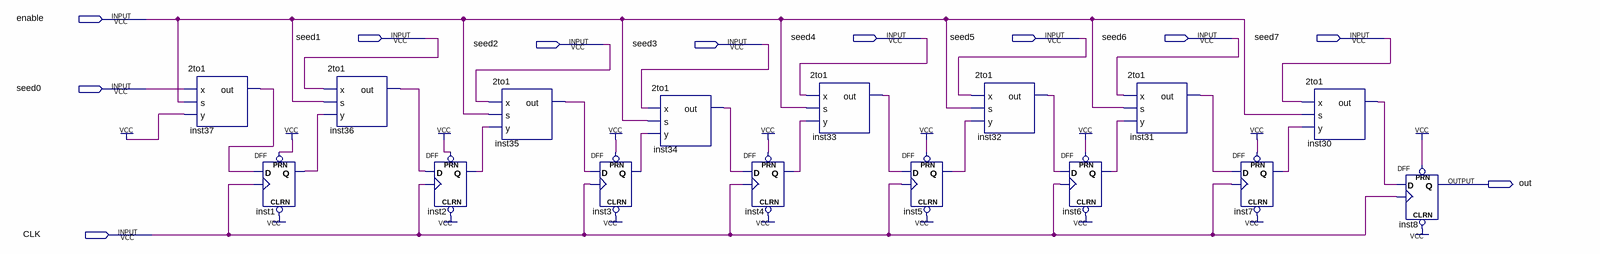
[diagram p0: schematic sheet]
// Quartus schematic 8bit.bdf as structural Verilog: 16 symbols, 11 pins
module \8bit  (
  input  enable,
  input  seed1,
  input  seed4,
  input  seed5,
  input  seed6,
  input  seed7,
  input  seed2,
  input  seed3,
  input  seed0,
  input  CLK,
  output out
);

  wire inst1_q, inst2_q, inst3_q, inst4_q, inst5_q, inst6_q, inst7_q, inst30_out, inst31_out, inst32_out,
       inst33_out, inst34_out, inst35_out, inst36_out, inst37_out;

  \2to1  inst37 (.x(seed0), .s(enable), .y(1'b1), .out(inst37_out));
  DFF inst1 (.CLRN(1'b1), .CLK(CLK), .D(inst37_out), .PRN(1'b1), .Q(inst1_q));
  \2to1  inst36 (.x(seed1), .s(enable), .y(inst1_q), .out(inst36_out));
  DFF inst2 (.CLRN(1'b1), .CLK(CLK), .D(inst36_out), .PRN(1'b1), .Q(inst2_q));
  \2to1  inst35 (.x(seed2), .s(enable), .y(inst2_q), .out(inst35_out));
  DFF inst3 (.CLRN(1'b1), .CLK(CLK), .D(inst35_out), .PRN(1'b1), .Q(inst3_q));
  \2to1  inst34 (.x(seed3), .s(enable), .y(inst3_q), .out(inst34_out));
  DFF inst4 (.CLRN(1'b1), .CLK(CLK), .D(inst34_out), .PRN(1'b1), .Q(inst4_q));
  \2to1  inst33 (.x(seed4), .s(enable), .y(inst4_q), .out(inst33_out));
  DFF inst5 (.CLRN(1'b1), .CLK(CLK), .D(inst33_out), .PRN(1'b1), .Q(inst5_q));
  \2to1  inst32 (.x(seed5), .s(enable), .y(inst5_q), .out(inst32_out));
  DFF inst6 (.CLRN(1'b1), .CLK(CLK), .D(inst32_out), .PRN(1'b1), .Q(inst6_q));
  \2to1  inst31 (.x(seed6), .s(enable), .y(inst6_q), .out(inst31_out));
  DFF inst7 (.CLRN(1'b1), .CLK(CLK), .D(inst31_out), .PRN(1'b1), .Q(inst7_q));
  \2to1  inst30 (.x(seed7), .s(enable), .y(inst7_q), .out(inst30_out));
  DFF inst8 (.CLRN(1'b1), .CLK(CLK), .D(inst30_out), .PRN(1'b1), .Q(out));
endmodule
